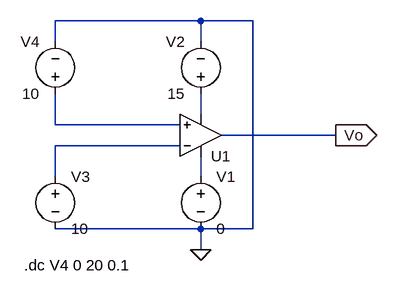
[diagram p0: schematic Draft1.asc]
Draft1.asc, the LTspice schematic file:
Version 4.1
SHEET 1 880 680
WIRE 224 0 0 0
WIRE 304 0 224 0
WIRE 0 32 0 0
WIRE 224 32 224 0
WIRE 224 144 224 112
WIRE 0 160 0 112
WIRE 192 160 0 160
WIRE 432 176 256 176
WIRE 192 192 0 192
WIRE 0 240 0 192
WIRE 224 240 224 208
WIRE 224 320 0 320
WIRE 304 320 304 0
WIRE 304 320 224 320
WIRE 224 352 224 320
FLAG 224 352 0
FLAG 432 176 Vo
IOPIN 432 176 Out
SYMBOL OpAmps\\UniversalOpAmp 224 176 M180
SYMATTR InstName U1
SYMBOL voltage 224 224 R0
SYMATTR InstName V1
SYMATTR Value 0
SYMBOL voltage 224 128 R180
WINDOW 0 24 96 Left 2
WINDOW 3 24 16 Left 2
SYMATTR InstName V2
SYMATTR Value 15
SYMBOL voltage 0 224 R0
SYMATTR InstName V3
SYMATTR Value 10
SYMBOL voltage 0 128 R180
WINDOW 0 24 96 Left 2
WINDOW 3 24 16 Left 2
SYMATTR InstName V4
SYMATTR Value 10
TEXT -48 376 Left 2 !.dc V4 0 20 0.1

The netlist it stands for:
* Draft1.asc
X§U1 N002 N003 N004 N001 Vo level1 Avol=1Meg GBW=10Meg Vos=0 En=0 Enk=0 In=0 Ink=0 Rin=500Meg  ; pins In+ In- V+ V- OUT
V1 N004 0 0
V2 N001 0 15
V3 N003 0 10
V4 N002 0 10
.dc V4 0 20 0.1
.lib UniversalOpAmp1.lib
.backanno
.end